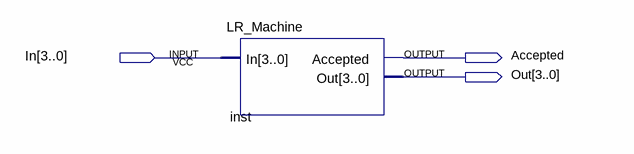
[diagram p0: schematic sheet]
// Quartus schematic LR_Test.bdf as structural Verilog: 1 symbols, 3 pins
module LR_Test (
  input  [3:0] In,
  output Accepted,
  output [3:0] Out
);

  LR_Machine inst (.In(In), .Accepted(Accepted), .Out(Out));
endmodule
